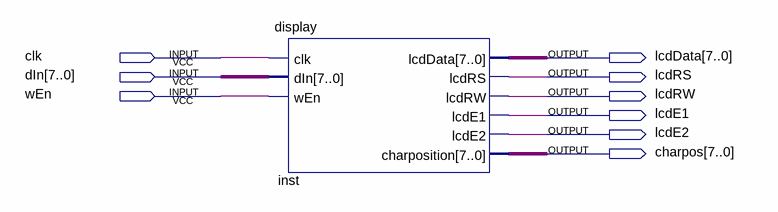
[diagram p0: schematic sheet]
// Quartus schematic Display_bdf.bdf as structural Verilog: 1 symbols, 9 pins
module Display_bdf (
  input  clk,
  input  [7:0] dIn,
  input  wEn,
  output [7:0] lcdData,
  output lcdRS,
  output lcdRW,
  output lcdE1,
  output lcdE2,
  output [7:0] charpos
);

  display inst (
    .clk(clk), .dIn(dIn), .wEn(wEn), .lcdData(lcdData), .lcdRS(lcdRS), .lcdRW(lcdRW), .lcdE1(lcdE1),
    .lcdE2(lcdE2), .charposition(charpos));
endmodule
